# Altium project PCB_Project1.PrjPCB
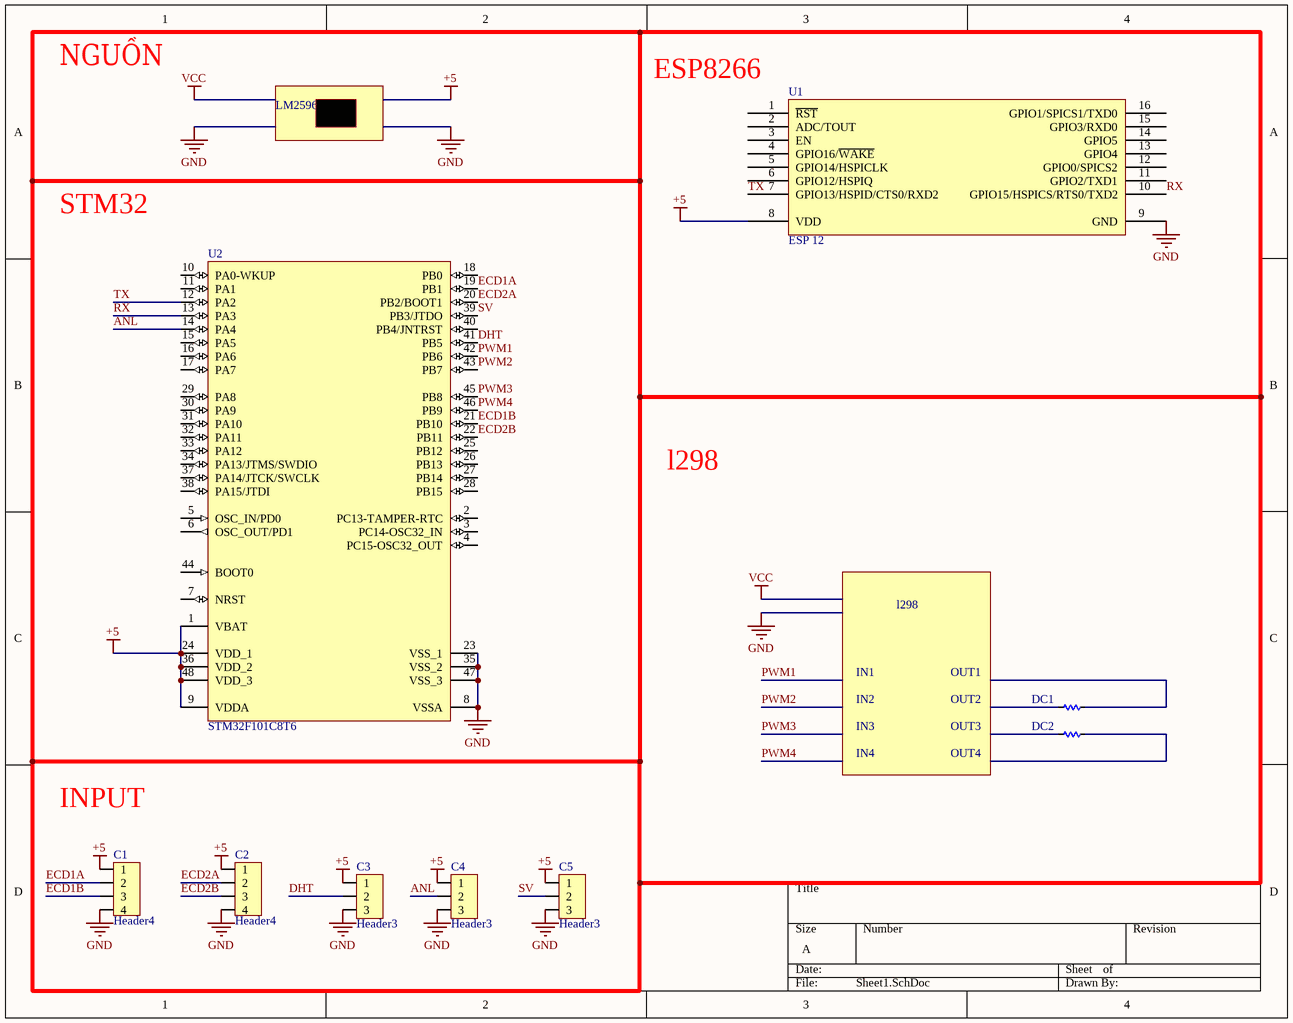
[diagram p0: Sheet1.SchDoc]
1 sheet, 9 parts. Net scope: global (net labels, ports and power ports of the same name join across sheets).

## Sheet Sheet1.SchDoc
size A

### Parts
C1  Header4  [HDR4]
C2  Header4  [HDR4]
C3  Header3  [HDR3]
C4  Header3  [HDR3]
C5  Header3  [HDR3]
DC1  Res  [RES-1/2W]  (value not drawn)
DC2  Res  [RES-1/2W]  (value not drawn)
U1  ESP 12  [ESP12]
U2  STM32F101C8T6  [TQFP48]

### Nets
+5: C1.1 C2.1 C3.1 C4.1 C5.1 U1.8(VDD) U2.1(VBAT) U2.9(VDDA) U2.24(VDD_1) U2.36(VDD_2) U2.48(VDD_3)
GND: C1.4 C2.4 C3.3 C4.3 C5.3 U1.9(GND) U2.8(VSSA) U2.23(VSS_1) U2.35(VSS_2) U2.47(VSS_3)
ANL: C4.2 U2.14(PA4)
DHT: C3.2 U2.41(PB5)
ECD1A: C1.2 U2.19(PB1)
ECD1B: C1.3 U2.21(PB10)
ECD2A: C2.2 U2.20(PB2/BOOT1)
ECD2B: C2.3 U2.22(PB11)
PWM1: U2.42(PB6)
PWM2: U2.43(PB7)
PWM3: U2.45(PB8)
PWM4: U2.46(PB9)
RX: U1.10(GPIO15/HSPICS/RTS0/TXD2) U2.13(PA3)
SV: C5.2 U2.39(PB3/JTDO)
TX: U1.7(GPIO13/HSPID/CTS0/RXD2) U2.12(PA2)

Not connected (* = marked no-connect by the designer): DC1 1 2; DC2 1 2; U1 1(~{RST}) 2(ADC/TOUT) 3(EN) 4(GPIO16/~{WAKE}) 5(GPIO14/HSPICLK) 6(GPIO12/HSPIQ) 11(GPIO2/TXD1) 12(GPIO0/SPICS2) 13(GPIO4) 14(GPIO5) 15(GPIO3/RXD0) 16(GPIO1/SPICS1/TXD0); U2 2(PC13-TAMPER-RTC) 3(PC14-OSC32_IN) 4(PC15-OSC32_OUT) 5(OSC_IN/PD0) 6(OSC_OUT/PD1) 7(NRST) 10(PA0-WKUP) 11(PA1) 15(PA5) 16(PA6) 17(PA7) 18(PB0) 25(PB12) 26(PB13) 27(PB14) 28(PB15) 29(PA8) 30(PA9) 31(PA10) 32(PA11) 33(PA12) 34(PA13/JTMS/SWDIO) 37(PA14/JTCK/SWCLK) 38(PA15/JTDI) 40(PB4/JNTRST) 44(BOOT0)

### Notes on the sheet
- NGUỒN
- (near U1) ESP8266
- LM2596
- STM32
- l298
- IN1
- IN2
- OUT1
- OUT2
- IN3
- IN4
- OUT3
- OUT4
- INPUT

### Library data of the parts
C1 C2 = Header4: Header IDC, 4 x 1 Pin Vertical 2.54mm Pitch (Non-Boxed, Male); Manufacturer: W¨¹rth Elektronik eiSos GmbH; partNo: 613002143121; ComponentLink1 Description: Manufacturer; ComponentLink2 Description: Datasheet; NoPins: 02; Created Date: 29 March 2013; ComponentLink1URL: http://www.we-online.com; ComponentLink2URL: http://katalog.we-online.de/em/datasheet/6130xx143121.pdf; Created by: Karrer Zheng
C3-C5 = Header3: Header IDC, 3 x 1 Pin Vertical 2.54mm Pitch (Non-Boxed, Male); Manufacturer: W¨¹rth Elektronik eiSos GmbH; partNo: 613002143121; ComponentLink1 Description: Manufacturer; ComponentLink2 Description: Datasheet; NoPins: 02; Created Date: 29 March 2013; ComponentLink1URL: http://www.we-online.com; ComponentLink2URL: http://katalog.we-online.de/em/datasheet/6130xx143121.pdf; Created by: Karrer Zheng
DC1 DC2 = Res: Manufacturer: Generic Components; Class: Passive; SubClass: R; Published: 08/06/2000; Publisher: Altium Hobart Technology Centre
U1 = ESP_12: ESP-12 Wi-Fi Module by AI-Thinker; IC: ESP8266-EX; Vendor: Ai-thinker
U2 = STM32F101C6T6: STM32 ARM-based 32-bit MCU with 32 Kbytes Flash, 48-pin LQFP, Industrial Temperature; Published: 30-May-2008; DatasheetVersion: rev6, Mar-2008; PackageVersion: Mar-2008; PackageReference: LQFP48; Publisher: Altium Limited; PackageDescription: 48-Pin Low-Profile Quad Flat Pack, 7 x 7 mm Body, 0.5 mm Pitch (LQFP48); ComponentLink1Description: Manufacturer Link; ComponentLink1URL: www.st.com/stm32; ComponentLink2Description: Datasheet; ComponentLink2URL: http://www.st.com/stonline/products/literature/ds/13586.pdf